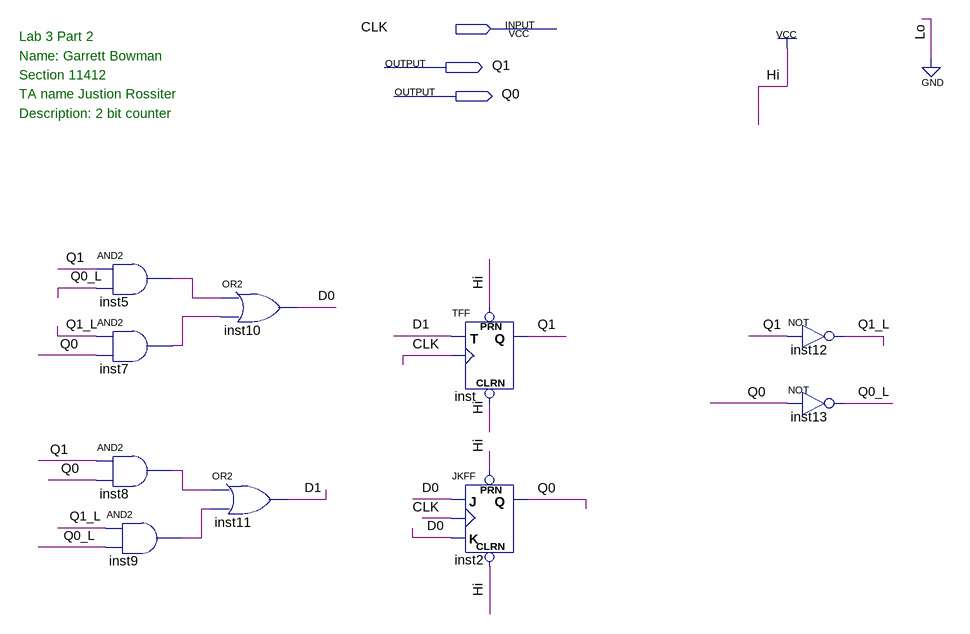
[diagram p0: schematic sheet]
// Quartus schematic Lab3_2bit_JK_T.bdf as structural Verilog: 10 symbols, 3 pins
module Lab3_2bit_JK_T (
  input  CLK,
  output Q1,
  output Q0
);

  wire D0, D1, inst5_out, inst7_out, inst8_out, inst9_out, Q0_L, Q1_L;

  and inst5 (inst5_out, Q1, Q0_L);
  and inst7 (inst7_out, Q1_L, Q0);
  and inst8 (inst8_out, Q1, Q0);
  and inst9 (inst9_out, Q1_L, Q0_L);
  or inst10 (D0, inst5_out, inst7_out);
  or inst11 (D1, inst8_out, inst9_out);
  TFF inst (.PRN(1'b1), .CLRN(1'b1), .T(D1), .CLK(CLK), .Q(Q1));
  JKFF inst2 (.PRN(1'b1), .CLRN(1'b1), .K(D0), .J(D0), .CLK(CLK), .Q(Q0));
  not inst12 (Q1_L, Q1);
  not inst13 (Q0_L, Q0);

  // Notes on the sheet:
  //   Lab 3 Part 2
  //   Name: Garrett Bowman
  //   Section 11412
  //   TA name Justion Rossiter
  //   Description: 2 bit counter
endmodule
